# Altium schematic sheet PWR_LMS3635.SchDoc
size A3; SheetNumber: 21; SheetTotal: 22
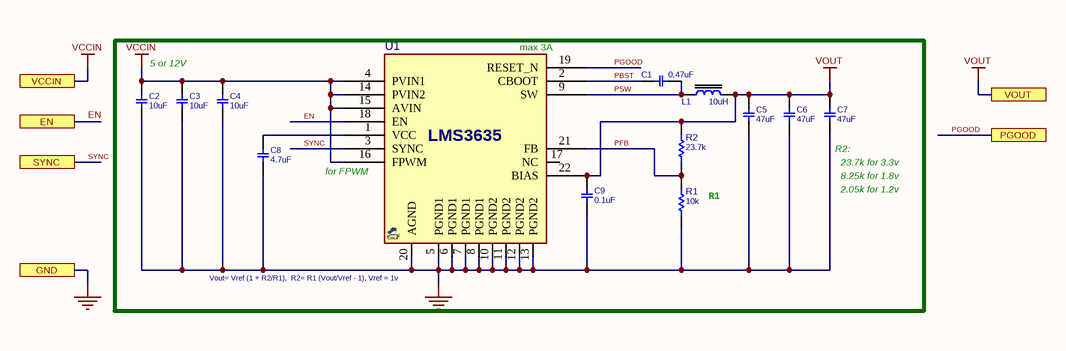
[diagram p0: PWR_LMS3635.SchDoc]

## Parts
C1  0.47uF  [C0402A]
C2  10uF  [C0805]
C3  10uF  [C0805]
C4  10uF  [C0805]
C5  47uF  [C0805A]
C6  47uF  [C0805A]
C7  47uF  [C0805A]
C8  4.7uF  [C0402A]
C9  0.1uF  [C0402A]
L1  10uH  [L_7]
R1  10k  [R0402A]
R2  23.7k  [R0402A]
U1  LMS3635  [QFNHR_22_RNL]  (value not drawn)

## Ports
EN, GND, PGOOD, SYNC, VCCIN, VOUT

## Nets
GND: C2.1 C3.1 C4.1 C5.2 C6.2 C7.2 C8.1 C9.2 R1.2 U1.5(PGND1) U1.6(PGND1) U1.7(PGND1) U1.8(PGND1) U1.10(PGND2) U1.11(PGND2) U1.12(PGND2) U1.13(PGND2) U1.20(AGND) ; port GND
VCCIN: C2.2 C3.2 C4.2 U1.4(PVIN1) U1.14(PVIN2) U1.15(AVIN) U1.16(FPWM) ; port VCCIN
VOUT: C5.1 C6.1 C7.1 C9.1 L1.2 R2.1 U1.22(BIAS) ; port VOUT
EN: U1.18(EN) ; port EN
PBST: C1.1 U1.2(CBOOT)
PFB: R1.1 R2.2 U1.21(FB)
PGOOD: U1.19(RESET_N) ; port PGOOD
PSW: C1.2 L1.1 U1.9(SW)
SYNC: U1.3(SYNC) ; port SYNC
NetC8_2: C8.2 U1.1(VCC)

Not connected (* = marked no-connect by the designer): U1 17(NC)

## Notes on the sheet
- 5 or 12V
- (near U1) max 3A
- (near U1) for FPWM
- R1
- (near C7) R2:
- (near C7) 23.7k for 3.3v
- 8.25k for 1.8v
- 2.05k for 1.2v
- (near U1) Vout= Vref (1 + R2/R1),  R2= R1 (Vout/Vref - 1), Vref = 1v

## Library data of the parts
C1 = CAP_SMD_MLCC_100n50V: CAP, MLCC; PARAM: X5R, 10%; PARAM2: 25v; MANF: -; DESC: -; ASSEMBLY: ASSEMBLY; PRICE: -; VALUE: 0.47uF; MANF_P#: -
C2-C4 = CAP_SMD_MLCC: CAP, MLCC; PARAM: X5R, 20%; MANF_P#: CL21A106KAYNNNE; MANF: Samsung; PARAM2: 25v; PRICE: 10,000: $0.034; ASSEMBLY: ASSEMBLY; VALUE: 10uF
C5-C7 = CAP_SMD_MLCC_47u25V: CAP, MLCC; PARAM: 6.3v; MANF: Samsung; PARAM2: X5R, 20%; DESC: CAP, MLCC, X5R 47uF 25V 20% 1206; MANF_P#: CL21A476MQYNNNE; PRICE: 500= 265$; VALUE: 47uF
C8 = CAP_SMD_MLCC: CAP, MLCC; PARAM: X5R, 20%; MANF: Samsung; PARAM2: 6.3v; PRICE: 10,000:	$0.013; MANF_P#: -; ASSEMBLY: ASSEMBLY; VALUE: 4.7uF
C9 = CAP_SMD_MLCC_100n50V: CAP, MLCC, 100nF, 50V, X7R, 10%, 0402C; PARAM: X5R, 10%; MANF: Murata; PARAM2: 25v; MANF_P#: GRM155R61E104; DESC: CAP, MLCC, 100nF, 50V, X7R, 10%, 0402C; ASSEMBLY: ASSEMBLY; PRICE: 10,000:$0.006; VALUE: 0.1uF
L1 = IND_SMD_2.2uH_4A: INDUCTOR; PARAM: 4A (Irms); MANF: KYOCERA AVX; PARAM2: 68mOhm; MANF_P#: LMLP07A7M100DTAS; PRICE: 0.25$; DESC: -; ASSEMBLY: ASSEMBLY; VALUE: 10uH
R1 R2 = RES_SMD: RESISTOR, SMD, 20K, 0402; PARAM: 0.063W; DIST#: MOUSER; PARAM2: 1%; MANF: -; ASSEMBLY: ASSEMBLY; PRICE: 100= 0.5$; DESC: RESISTOR, SMD, 20K, 0402; MANF_P#: -
  R1: VALUE: 10k
  R2: VALUE: 23.7k
U1 = VREG_LMS3635MQRNL_QFN22: REG, Switching, Buck, 3.9~36Vin, 3.5A, RNL-22; MANF: Texas Instruments; PARAM: 3.5A, 0.4MHz; PARAM2: 3.9~36VIN,1~20Vout; PRICE: 5$; ASSEMBLY: ASSEMBLY; MANF_P#: LMS3635MQRNL; VALUE: LMS3635; PACKAGE: QFN-22 RNL